# EasyEDA schematic 1-Schematic.json
TITLE: FM Converter; REV: 1.0; Date: 2019-12-07; Sheet: 1/1; Drawn By: tardate; Company: leap.tardate.com
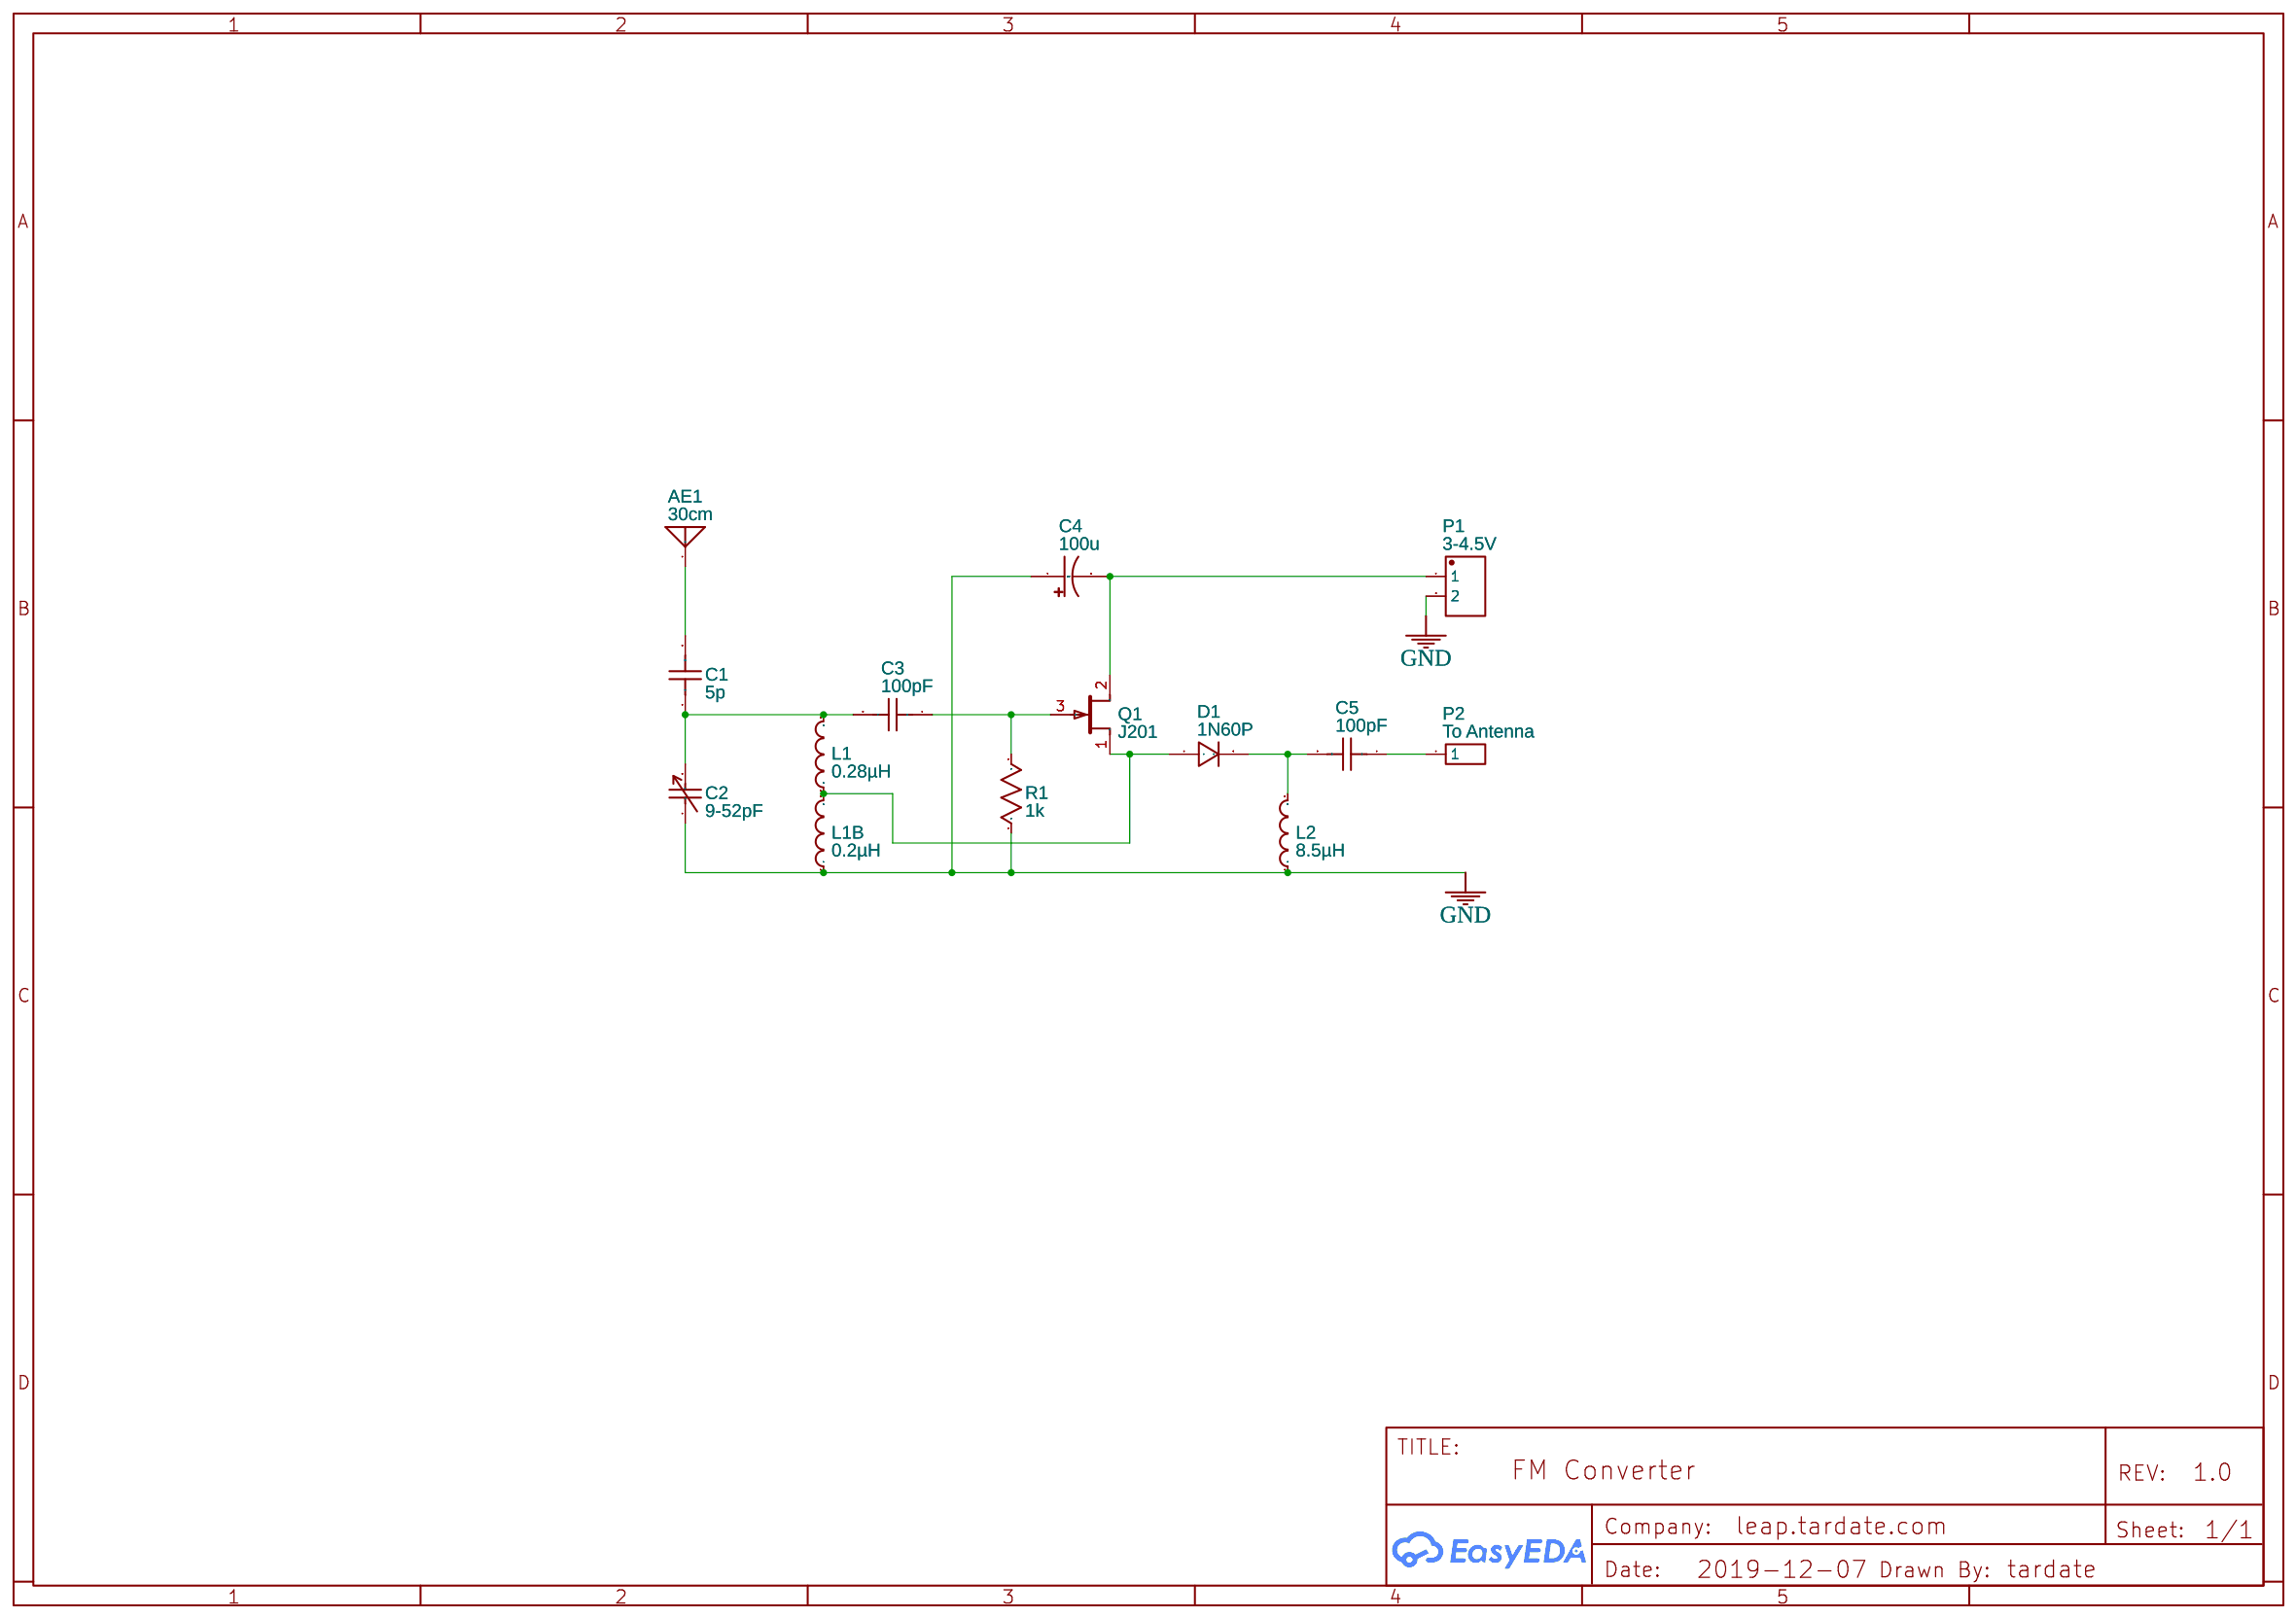
[diagram p0: schematic sheet]

## Parts
#1  -
AE1  30cm  [ANT-SMD_2450AT18A100E]
C1  5p  [RAD-0.1]
C2  9-52pF  [CAP-TH_JML06-1]
C3  100pF  [RAD-0.1]
C4  100u  [CAP-D3.0XF1.5]
C5  100pF  [RAD-0.1]
D1  1N60P  [DO-35]
L1  0.28µH  [AXIAL-0.4]
L1B  0.2µH  [AXIAL-0.4]
L2  8.5µH  [AXIAL-0.4]
P1  3-4.5V  [WJ2EDGVC-5.08-2P]
P2  To Antenna  [HDR-1X1/2.54]
Q1  J201  [SOT-23]
R1  1k  [AXIAL-0.3]

## Library data of the parts
#1 = -: BOM_Manufacturer Part: ?
AE1 = -: Supplier: LCSC; Supplier Part: C89334; Manufacturer: Johanson Dielectrics; Manufacturer Part: 2450AT18A100E; Contributor: LCSC
C1 C3 C5 = Cap_RAD-0.1_US
C2 = JML06-1-50P: Supplier: LCSC; Manufacturer: JML; Contributor: LCSC; Supplier Part: C10481
C4 = Cap_Electrolytic(TH)_D3.0XF1.5_US
D1 = -: Supplier: LCSC; Manufacturer: SEMTECH; Manufacturer Part: 1N4448; image: //image.lceda.cn/szlcsc/C54037.jpg; Supplier Part: C54037
L1 L1B L2 = Inductor_AXIAL-0.4_US
P1 = -: Supplier: LCSC; Manufacturer: ReliaPro; image: //image.lceda.cn/szlcsc/C8445.jpg; Supplier Part: C8445
P2 = -: Supplier: LCSC; Manufacturer: ReliaPro; Manufacturer Part: Header-Male-2.54_1x1; Supplier Part: C81276
Q1 = -: Supplier: LCSC; Manufacturer: ON; Manufacturer Part: MMBFJ310LT1G; image: //image.lceda.cn/szlcsc/C33416.jpg; Supplier Part: C33416; LCSC Assembly: Yes; SMT Type: Extend
R1 = Res_AXIAL-0.3(1/8W)_US

## Nets
GND: C2.1 C4.1 L1B.1 L2.1 P1.2 R1.1
Net-(AE1-1): AE1.1 C1.2
Net-(C1-1): C1.1 C2.2 C3.2 L1.2
Net-(C3-1): C3.1 Q1.3(G) R1.2
Net-(C4-2): C4.2 P1.1 Q1.2(S)
Net-(C5-1): C5.1 P2.1
Net-(C5-2): C5.2 D1.2(K) L2.2
Net-(D1-1): D1.1(A) L1.1 L1B.2 Q1.1(D)
